# EasyEDA Pro project ProDoc_PCB_PCB_ESP32-sd-int_2026-03-25.epro

# Board PCB_PCB_ESP32-sd-int
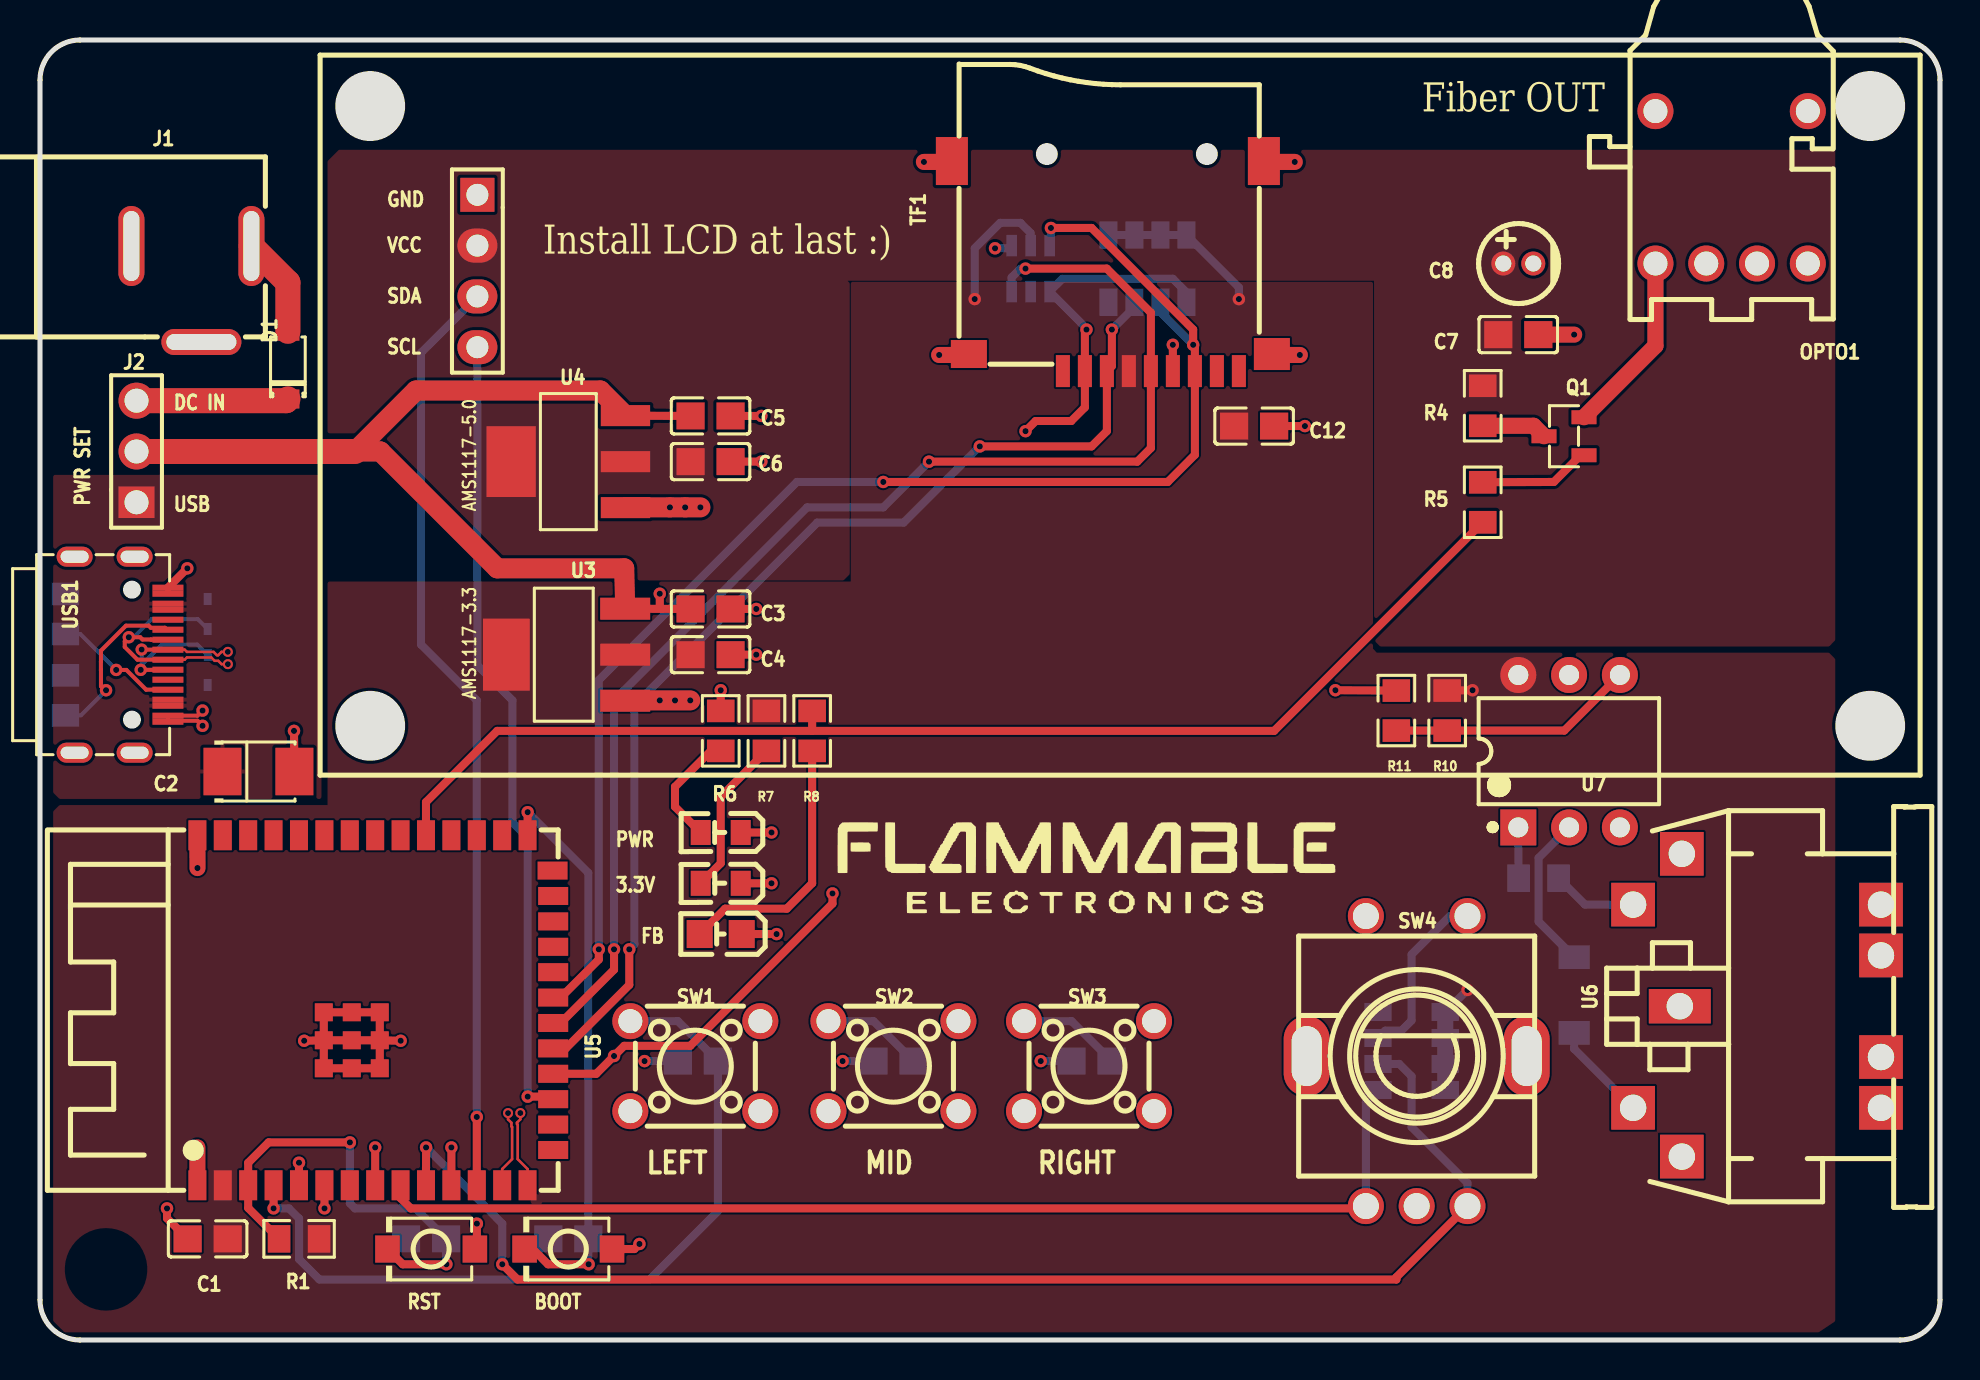
[diagram p0: board, top side]
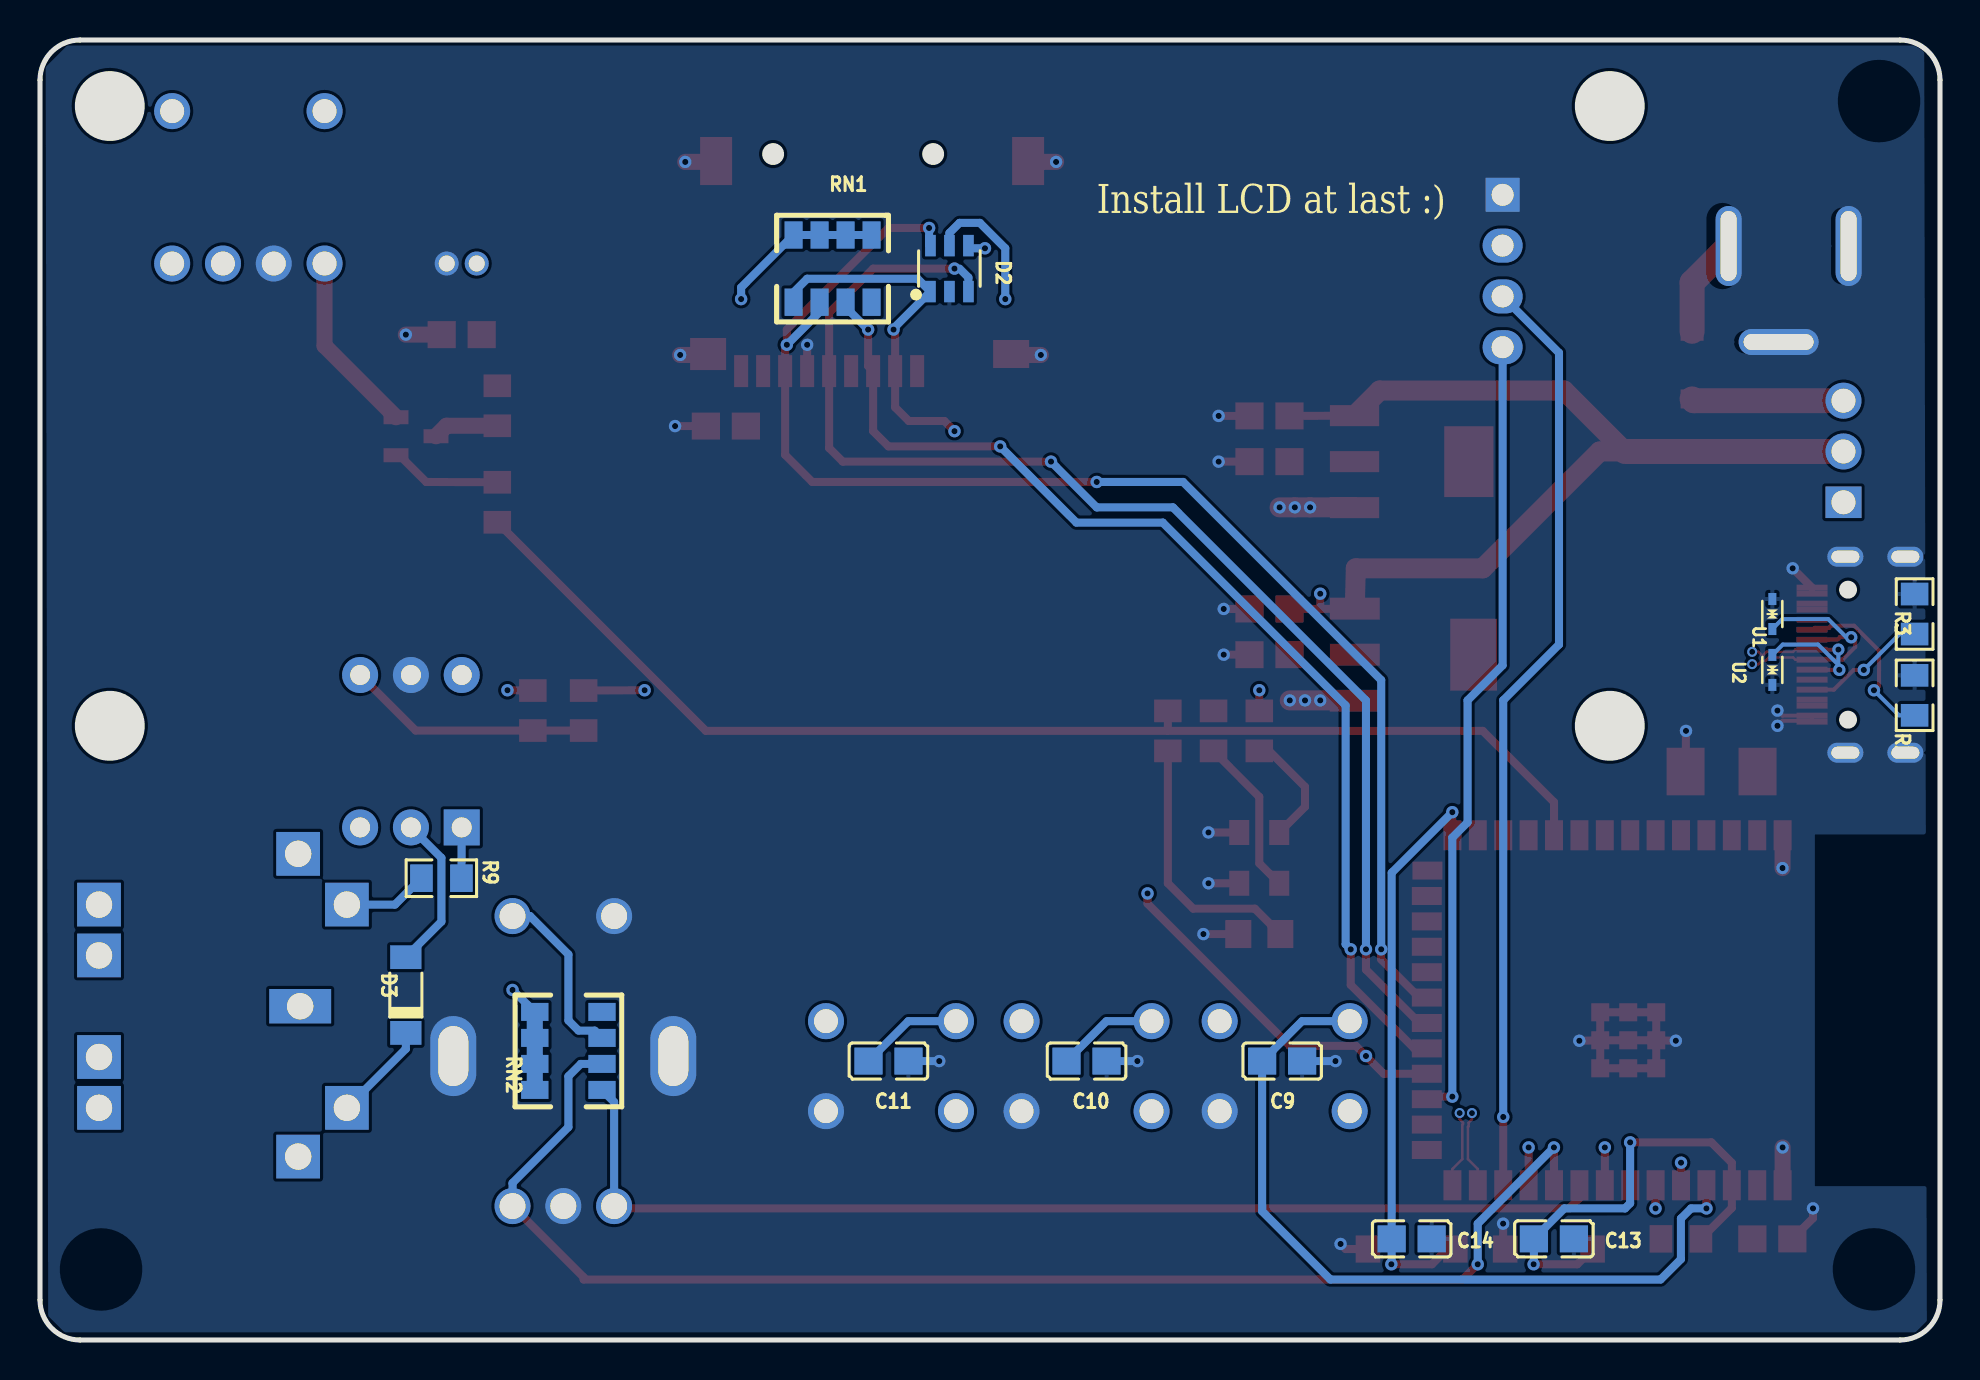
[diagram p1: board, bottom side, seen from below]

Outline 95 x 65 mm; copper layers: Top Layer, Inner1, Inner2, Inner3, Inner4, Inner5, Inner6, Inner7, Inner8, Inner9, Inner10, Inner11, Inner12, Inner13, Inner14, Inner15, Inner16, Inner17, Inner18, Inner19, Inner20, Inner21, Inner22, Inner23, Inner24, Inner25, Inner26, Inner27, Inner28, Inner29, Inner30, Bottom Layer. Coordinates in mm from the lower left corner of the outline.
Outline path: 0,63 arc(0.59,64.41) 2,65 93,65 arc(94.41,64.41) 95,63 95,2 arc(94.41,0.59) 93,0 2,0 arc(0.59,0.59) 0,2 0,63
Stack: Top Layer 0.035mm / Dielectric1 0.48mm PP er 4.5 / Inner1 0.035mm / Dielectric2 0.48mm FR4 er 4.5 / Inner2 0.035mm / Dielectric3 0.48mm PP er 4.5 / Bottom Layer 0.035mm

## Design rules (mm)
net USB_P: DP1
net USB_N: DP1
template: User Custom Config
spacing Default (default): track to track 0.1, other pairs 0 to 0.1
track width Default (default): min 0.254, default 0.254, max 25.4
differential pair differentialPair (default): width min 0.127, default 0.127, max 0.127; gap min 0.152, default 0.152
via Default (default): diameter min 0.5, default 0.6, max 100.025; hole min 0.3, default 0.305, max 59.995
pour e112 uses gge9877
pour e150 uses gge9877(1)
pour e340 uses gge17314
pour e342 uses gge17404
pour e344 uses gge17428
pour e346 uses gge21029

## Placement (name value [footprint] x y rotation side)
C1  100nF  [C0805]  8.38 5.06 0 top
C2  10uF  [CAP-SMD_L3.2-W2.8-FD]  10.92 28.42 0 top
C3  10uF  [C0805]  33.53 36.55 180 top
C4  10uF  [C0805]  33.53 34.27 180 top
C5  10uF  [C0805]  33.53 46.2 180 top
C6  10uF  [C0805]  33.53 43.92 180 top
C7  100nF  [C0805]  73.91 50.27 0 top
C8  10uF  [CAP-TH_BD4.0-P1.50-D0.8-FD]  73.91 53.82 0 top
C9  100nF  [C0805]  32.89 13.95 0 bottom
C10  100nF  [C0805]  42.67 13.95 0 bottom
C11  100nF  [C0805]  52.58 13.95 0 bottom
C12  100nF  [C0805]  60.71 45.7 0 top
C13  100nF  [C0805]  19.3 5.06 0 bottom
C14  100nF  [C0805]  26.42 5.06 0 bottom
D1  DSS34  [SOD-123_L2.8-W1.8-LS3.7-RD]  12.39 48.74 90 top
D2  BV-SRV05-4  [SOT-23-6_L2.9-W1.6-P0.95-LS2.8-BL]  49.53 53.57 180 bottom
D3  1N4148-1206D  [LL-34_L3.5-W1.5-R-RD]  76.71 17.25 90 bottom
J1  9V Battery  [DC-IN-TH_DC-5520-1]  7.57 52.3 0 top
J2  Power settings  [HDR-TH_3P-P2.54-V-M-1]  4.83 44.43 90 top
LCD1  -  [I2CLCD16X2]  16.51 30.71 0 top
LED1  0805 SF-RED  [LED0805-RD_RED]  34.04 22.84 180 top
LED2  SF-RED  [LED0805-RD_RED]  34.04 25.38 180 top
LED3  YLED0805G  [LED0805-FD-GREEN]  34.03 20.3 0 top
OPTO1  HFBR-1521Z  [CONN-TH_HFBR-1521Z]  84.58 57.63 180 top
Q1  SS8050S  [SOT-23-3_L2.9-W1.3-P0.95-LS2.4-BR]  76.2 45.19 0 top
R1  10kΩ  [R0805]  12.95 5.06 0 top
R2  5.1kΩ  [R0805]  1.27 32.23 270 bottom
R3  5.1kΩ  [R0805]  1.27 36.3 270 bottom
R4  33Ω  [R0805]  72.14 46.71 90 top
R5  470Ω  [R0805]  72.14 41.89 90 top
R6  10kΩ  [R0805]  34.04 30.46 90 top
R7  1.3kΩ  [R0805]  36.32 30.46 90 top
R8  2.2kΩ  [R0805]  38.61 30.46 270 top
R9  220Ω  [R0805]  74.93 23.09 180 bottom
R10  180Ω  [R0805]  70.36 31.47 270 top
R11  47Ω  [R0805]  67.82 31.47 90 top
RN1  10kΩ  [RES-ARRAY-SMD_1206-8P-L5.1-W3.1-BL]  55.37 53.57 180 bottom
RN2  10kΩ  [RES-ARRAY-SMD_1206-8P-L5.1-W3.1-BL]  68.58 14.45 90 bottom
SW1  TC-6610-18.0  [SW-TH_4P-L6.0-W6.0-P4.50-LS6.5]  32.77 13.69 0 top
SW2  TC-6610-18.0  [SW-TH_4P-L6.0-W6.0-P4.50-LS6.5]  42.67 13.69 0 top
SW3  TC-6610-18.0  [SW-TH_4P-L6.0-W6.0-P4.50-LS6.5]  52.45 13.69 0 top
SW4  EC11E18244A5  [SW-TH_EC11E18244A5]  68.83 13.95 0 top
SW5  TS-1088-AR02016  [SW-SMD_L3.9-W3.0-P4.45]  19.56 4.55 180 top
SW6  TS-1088-AR02016  [SW-SMD_L3.9-W3.0-P4.45]  26.42 4.55 180 top
TF1  SD  [TF-SMD_TF-15-15]  53.59 53.7 90 top
U1  LESD5D5.0CT1G_C5246195  [SOD-523_L1.2-W0.8-LS1.6-BI]  8.38 36.3 270 bottom
U2  LESD5D5.0CT1G_C5246195  [SOD-523_L1.2-W0.8-LS1.6-BI]  8.38 33.5 90 bottom
U3  AMS1117-3.3  [SOT-223-3_L6.5-W3.4-P2.30-LS7.0-BR]  26.29 34.27 0 top
U4  AMS1117-5.0  [SOT-223_L6.5-W3.5-P2.30-LS7.0-BR]  26.42 43.92 0 top
U5  ESP32-S3-WROOM-1(N8R8)  [WIRELM-SMD_ESP32-S3-WROOM-1]  16.76 16.49 90 top
U6  MIDIJACK  [CP-2350]  85.85 16.74 90 top
U7  H11L1  [DIP-6_L8.5-W6.4-P2.54-LS7.6-BL]  76.45 29.44 0 top
USB1  MUP-U20409-2  [USB-C-SMD_MUP-U20409-2]  4.06 34.27 270 top

## Footprints (pads in the part's own frame, mm; a bottom-side part is the same pattern mirrored in y, then rotated)
C0805
  rect 1.41x1.35 smd: 1(-1,0) 2(1,0)
CAP-SMD_L3.2-W2.8-FD
  rect 1.9x2.376 smd: 1(-1.798,0) 2(1.798,0)
CAP-TH_BD4.0-P1.50-D0.8-FD
  round 1.2 hole 0.8: 1(-0.75,0) 2(0.75,0)
CONN-TH_HFBR-1521Z
  round 1.8 hole 1.2: 1(3.81,3.81) 2(1.27,3.81) 3(-1.27,3.81) 4(-3.81,3.81) 5(-3.81,-3.81) 8(3.81,-3.81)
CP-2350
  rect 2.184x2.184 hole 1.321: 1(7.569,3.76) 3(-7.569,3.76) 4(5.029,6.197) 5(-5.131,6.197) PE(-2.591,-6.197) PE1(-5.131,-6.197) PE2(5.029,-6.197) PE@(2.489,-6.197)
  rect 1.72x3.096 hole 1.321: 2(-0.051,3.861)
DC-IN-TH_DC-5520-1
  oval 4x1.3 hole 3.5x0.8: 2(0.5,-2.4)
  oval 1.3x4 hole 0.8x3.5: 3(-3,2.4) 4(3,2.4)
DIP-6_L8.5-W6.4-P2.54-LS7.6-BL
  rect 1.8x1.8 hole 1: 1(-2.54,-3.81)
  round 1.8 hole 1: 2(0,-3.81) 3(2.54,-3.81) 4(2.54,3.81) 5(0,3.81) 6(-2.54,3.81)
HDR-TH_3P-P2.54-V-M-1
  rect 1.575x1.8 hole 1.2: 1(-2.54,0)
  round 1.8 hole 1.2: 2(0,0) 3(2.54,0)
I2CLCD16X2
  rect 1.7x1.7 hole 1.1: 1(5.359,26.549)
  oval 2x1.7 hole 1.1: 2(5.359,24.009) 3(5.359,21.469) 4(5.359,18.929)
LED0805-FD-GREEN
  rect 1.3x1.399 smd: 1(-1.05,0) 2(1.05,0)
LED0805-RD_RED
  rect 1x1.25 smd: 1(-1,0) 2(1,0)
LL-34_L3.5-W1.5-R-RD
  rect 1.185x1.566 smd: 1(1.893,0) 2(-1.893,0)
R0805
  rect 1.133x1.377 smd: 1(-1,0) 2(1,0)
RES-ARRAY-SMD_1206-8P-L5.1-W3.1-BL
  rect 0.9x1.37 smd: 1(-1.95,-1.68) 2(-0.65,-1.68) 3(0.65,-1.68) 4(1.95,-1.68) 5(1.95,1.68) 6(0.65,1.68) 7(-0.65,1.68) 8(-1.95,1.68)
SOD-123_L2.8-W1.8-LS3.7-RD
  rect 0.95x1.15 smd: 1(-1.692,0) 2(1.692,0)
SOD-523_L1.2-W0.8-LS1.6-BI
  rect 0.6x0.4 smd: 1(-0.75,0) 2(0.75,0)
SOT-23-3_L2.9-W1.3-P0.95-LS2.4-BR
  rect 1.25x0.7 smd: 1(1,-0.95) 2(1,0.95) 3(-1,0)
SOT-23-6_L2.9-W1.6-P0.95-LS2.8-BL
  rect 0.532x1.072 smd: 1(-0.95,-1.149) 2(0,-1.149) 3(0.95,-1.149) 4(0.95,1.149) 5(0,1.149) 6(-0.95,1.149)
SOT-223-3_L6.5-W3.4-P2.30-LS7.0-BR
  rect 2.5x1.1 smd: 1(2.97,-2.3) 2(2.97,0) 3(2.97,2.3)
  rect 2.34x3.6 smd: 4(-2.97,0)
SOT-223_L6.5-W3.5-P2.30-LS7.0-BR
  rect 2.465x1.05 smd: 1(2.857,-2.3) 2(2.857,0) 3(2.857,2.3)
  rect 2.465x3.54 smd: 4(-2.857,0)
SW-SMD_L3.9-W3.0-P4.45
  rect 1.23x1.36 smd: 1(-2.185,0) 2(2.185,0)
SW-TH_4P-L6.0-W6.0-P4.50-LS6.5
  round 1.8 hole 1.2: 1(-3.25,2.25) 2(3.25,2.25) 3(-3.25,-2.25) 4(3.25,-2.25)
SW-TH_EC11E18244A5
  oval 2.3x4 hole 1.5x3: 6(5.5,0.25) 7(-5.5,0.25)
  round 1.8 hole 1.3: A(-2.54,-7.25) B(2.54,-7.25) C(0,-7.25) D(-2.54,7.25) E(2.54,7.25)
TF-SMD_TF-15-15
  rect 1.6x0.701 smd: 1(-5.252,2.45) 2(-5.252,1.35) 3(-5.252,0.25) 4(-5.252,-0.85) 5(-5.252,-1.95) 6(-5.252,-3.05) 7(-5.252,-4.15) 8(-5.252,-5.25) 9(-5.252,-6.35)
  rect 1.6x1.8 smd: 10(-4.399,-8)
  rect 2.4x1.6 smd: 11(5.252,-7.6) 12(5.252,8)
  rect 1.399x1.801 smd: 13(-4.398,7.151)
USB-C-SMD_MUP-U20409-2
  oval 1x1.8 hole 0.6x1.4: 17(4.9,0.667) 18(4.9,-2.333) 19(-4.9,-2.333) 20(-4.9,0.667)
  rect 0.3x1.55 smd: A1(-3.35,2.333) A4(-2.55,2.333) A5(-1.25,2.333) A6(-0.25,2.333) A7(0.25,2.333) A8(1.25,2.333) A9(2.55,2.333) A12(3.35,2.333) B1(3.05,2.333) B4(2.25,2.333) B5(1.75,2.333) B6(0.75,2.333) B7(-0.75,2.333) B8(-1.75,2.333) B9(-2.25,2.333) B12(-3.05,2.333)
WIRELM-SMD_ESP32-S3-WROOM-1
  rect 1.5x0.9 smd: 1(-8.75,8.895) 2(-8.75,7.625) 3(-8.75,6.355) 4(-8.75,5.085) 5(-8.75,3.815) 6(-8.75,2.545) 7(-8.75,1.275) 8(-8.75,0.005) 9(-8.75,-1.265) 10(-8.75,-2.535) 11(-8.75,-3.805) 12(-8.75,-5.075) 13(-8.75,-6.345) 14(-8.75,-7.615) 27(8.75,-7.615) 28(8.75,-6.345) 29(8.75,-5.075) 30(8.75,-3.805) 31(8.75,-2.535) 32(8.75,-1.265) 33(8.75,0.005) 34(8.75,1.275) 35(8.75,2.545) 36(8.75,3.815) 37(8.75,5.085) 38(8.75,6.355) 39(8.75,7.625) 40(8.75,8.895)
  rect 0.9x1.5 smd: 15(-6.985,-8.895) 16(-5.715,-8.895) 17(-4.445,-8.895) 18(-3.175,-8.895) 19(-1.905,-8.895) 20(-0.635,-8.895) 21(0.635,-8.895) 22(1.905,-8.895) 23(3.175,-8.895) 24(4.445,-8.895) 25(5.715,-8.895) 26(6.985,-8.865)
  rect 0.9x0.9 smd: 41(-2.9,2.575) 41(-2.9,1.175) 41(-2.9,-0.225) 41(-1.5,2.575) 41(-1.5,1.175) 41(-1.5,-0.226) 41(-0.1,2.575) 41(-0.1,1.175) 41(-0.1,-0.225)

## Nets
+3.3V: C1.2 C4.2 C12.1 D2.5 R1.2 R7.2 R10.1 RN1.5 RN1.6 RN1.7 RN1.8 RN2.5 RN2.6 RN2.7 RN2.8 TF1.4 U3.2 U3.4 U5.2 U7.6
+5V: C6.2 C7.1 C8.1 LCD1.2 R4.2 U4.2 U4.4
GND: C1.1 C2.2 C3.1 C4.1 C5.1 C6.1 C7.2 C8.2 C9.1 C10.1 C11.1 C12.2 C13.1 C14.1 D2.2 J1.2 J1.3 LCD1.1 LED1.1 LED2.1 LED3.2 OPTO1.2 R2.1 R3.1 SW1.4 SW2.4 SW3.4 SW4.6 SW4.7 SW4.C SW4.D SW5.1 SW6.1 TF1.6 TF1.10 TF1.11 TF1.12 TF1.13 U1.1 U2.1 U3.1 U4.1 U5.1 U5.40 U5.41 U7.5 USB1.17 USB1.18 USB1.19 USB1.20 USB1.A1 USB1.A12 USB1.B1 USB1.B12
VBUS: C2.1 J2.1 USB1.A4 USB1.A9 USB1.B4 USB1.B9
VIN: D1.2 J1.4
BTN1: C9.2 SW1.1 U5.4
BTN2: C10.2 SW2.1 U5.5
BTN3: C11.2 SW3.1 U5.6
CHIP_EN: C13.2 R1.1 SW5.2 U5.3
CLK: D2.3 TF1.5 U5.20
CS: D2.1 RN1.1 TF1.2 U5.18
ENC_A: RN2.1 SW4.A U5.9
ENC_B: RN2.2 SW4.B U5.10
ENC_SW: RN2.3 SW4.E U5.11
FB: R5.1 R8.1 U5.31
IO0: C14.2 SW6.2 U5.27
MIDI_RX: R11.2 U5.8
MISO: D2.6 RN1.2 TF1.7 U5.21
MOSI: D2.4 RN1.3 TF1.3 U5.19
SCLK: LCD1.4 U5.17
SDA: LCD1.3 U5.12
USB_N: U1.2 U5.13 USB1.A7 USB1.B7
USB_P: U2.2 U5.14 USB1.A6 USB1.B6
VSET: C3.2 C5.2 J2.2 R6.2 U3.3 U4.3
$1N2: R3.2 USB1.B5
$1N4: R2.2 USB1.A5
$1N45: Q1.1 R5.2
$1N72: D1.1 J2.3
$1N93: LED2.2 R6.1
$1N100: R9.1 U6.4
$1N101: R9.2 U7.1
$1N102: D3.1 U7.2
$1N103: D3.2 U6.5
$1N106: R10.2 R11.1 U7.4
$1N109: Q1.3 R4.1
$1N110: OPTO1.1 Q1.2
$1N111: LED3.1 R8.2
$1N114: LED1.2 R7.1

Pads without a net: OPTO1 3 4 5 8; RN1 4; RN2 4; SW1 2 3; SW2 2 3; SW3 2 3; TF1 1 8 9; U5 7 15 16 22 23 24 25 26 28 29 30 32 33 34 35 36 37 38 39; U6 1 2 3 PE PE1 PE2 PE@; U7 3; USB1 A8 B8

## Via types
v1: diameter 0.62, hole 0.31, Top Layer to Bottom Layer, 73 vias
v2: diameter 0.5, hole 0.3, Top Layer to Bottom Layer, 4 vias
v3: diameter 0.61, hole 0.305, Top Layer to Bottom Layer, 1 via

## Routing (per net, layer and track width the routed paths; a pad name or vN(x,y) marks a point on that pad's centre or on a via; arc(x,y) is an arc through that point)
+3.3V: length 21.6
  Top Layer w0.402: R10.1 v1(71.63,32.49)
  Bottom Layer w0.402: v1(46.74,52.05) 46.74,54.59 48.01,55.86 49.02,55.86 49.53,55.35 D2.5 ; RN1.5 RN1.6 RN1.7 RN1.8 59.94,52.63 v1(59.94,52.05) ; RN2.5 v1(71.37,17.5)
  Bottom Layer w0.803: RN2.8 RN2.7 RN2.6 RN2.5
GND: length 64.8
  Top Layer w0.201: v1(8.13,31.47) 7.87,31.22 USB1.B1 USB1.A12 6.44,30.96 7.87,30.96 v1(8.13,30.71) ; USB1.A1 USB1.B12
  Top Layer w0.402: C4.1 v1(35.81,34.27) ; 16.99,14.99 U5.41 U5.41 U5.41 ; 16.99,14.99 U5.41 U5.41 U5.41 ; 16.99,14.99 U5.41 ; USB1.A1 7.36,38.58 ; v1(13.21,14.96) 14.19,14.98 ; C1.1 6.35,6.09 v1(6.35,6.58) ; C2.2 v1(12.7,30.46) ; C12.2 v1(63.25,45.7) ; LED1.1 v1(36.58,22.84) ; 56.64,48.44 v1(56.64,49.76) ; C6.1 v1(36.07,43.92) ; v1(29.97,4.8) 29.72,4.55 SW6.1 ; LED2.1 v1(36.58,25.38) ; C5.1 v1(36.07,46.2) ; 35.09,20.3 v1(36.83,20.3) ; C3.1 v1(35.81,36.55) ; 16.99,14.98 v1(18.03,14.96) ; v1(21.84,5.82) 21.84,4.65 SW5.1
  Top Layer w0.803: v1(62.74,58.9) 61.24,58.9 TF1.11 ; TF1.13 46.4,49.25 v1(44.96,49.25) ; TF1.12 45.55,58.9 v1(44.2,58.9) ; TF1.10 61.64,49.25 v1(62.99,49.25) ; C7.2 v1(76.71,50.27) ; U5.1 v1(7.87,9.63) ; U5.40 v1(7.87,23.6)
  Top Layer w1: v1(33.02,41.63) v1(32.26,41.63) v1(31.5,41.63) 29.29,41.63 29.27,41.62 ; v1(32.51,31.98) 29.29,31.98 29.26,31.95
  Bottom Layer w0.402: v1(40.13,13.95) C10.1 ; C9.1 v1(30.23,13.95) ; v1(50.04,13.95) C11.1
  vias: v1(7.37,38.58) v1(30.99,31.98) v1(31.75,31.98)
VIN: length 5
  Top Layer w1.25: D1.2 12.39,52.87 J1.4
BTN1: length 40.2
  Top Layer w0.402: U5.4 v1(11.68,6.58)
  Bottom Layer w0.402: SW1.1 31.9,15.94 C9.2 33.89,6.44 30.48,3.02 13.97,3.02 12.95,4.04 12.95,6.07 12.45,6.58 v1(11.68,6.58)
BTN2: length 38.1
  Top Layer w0.402: U5.5 v1(12.95,8.87)
  Inner1 w0.402: v1(12.95,8.87) 36.58,8.87 37.59,9.88 37.59,14.11 SW2.1
  Bottom Layer w0.402: SW2.1 41.68,15.94 C10.2
BTN3: length 47.6
  Top Layer w0.402: v1(14.22,6.58) U5.6
  Inner1 w0.402: SW3.1 47.5,14.24 47.5,10.14 43.94,6.58 v1(14.22,6.58)
  Bottom Layer w0.402: SW3.1 51.58,15.94 C11.2
CHIP_EN: length 23.1
  Top Layer w0.402: v1(15.49,9.88) 11.43,9.88 10.41,8.86 U5.3 10.41,6.6 R1.1 ; v1(20.32,3.79) 18.13,3.79 SW5.2
  Bottom Layer w0.402: v1(15.49,9.88) 15.49,6.83 15.75,6.58 18.78,6.58 C13.2 20.3,3.8 v1(20.32,3.79)
CLK: length 65
  Top Layer w0.402: v1(28.7,19.53) 28.7,18.52 26.03,15.85 25.66,15.85 ; v1(44.45,43.92) 54.86,43.92 55.54,44.6 TF1.5 ; 55.54,48.44 55.54,51.37 53.34,53.57 v1(49.28,53.57)
  Bottom Layer w0.402: v1(28.7,19.53) 28.7,31.98 38.35,41.63 42.16,41.63 v1(44.45,43.92) ; 49.02,53.57 48.58,53.13 D2.3
CS: length 63
  Top Layer w0.402: v1(49.28,45.44) 49.78,45.95 51.56,45.95 52.24,46.63 TF1.2 52.24,50.44 v1(52.32,50.52) ; 25.66,13.31 27.81,13.31 v1(28.7,14.2) 29.21,14.71 32.51,14.71 39.62,21.82 v1(39.62,22.33)
  Inner1 w0.402: v1(49.28,45.44) 49.28,31.98 v1(39.62,22.33)
  Bottom Layer w0.402: RN1.1 57.32,52.38 56.64,53.06 51.12,53.06 D2.1 52.32,50.58 v1(52.32,50.52)
ENC_A: length 55.2
  Top Layer w0.402: U5.9 18.03,7.09 18.54,6.58 66.18,6.58 SW4.A
  Bottom Layer w0.402: RN2.1 66.29,11.9 SW4.A
ENC_B: length 69.1
  Top Layer w0.402: v1(23.11,3.79) 23.88,3.02 67.82,3.02 67.82,3.14 SW4.B ; 19.3,7.74 19.3,8.61 19.3,8.61 v1(19.3,9.63)
  Bottom Layer w0.402: RN2.2 67.96,13.8 68.58,13.18 68.58,10.64 71.37,7.85 SW4.B ; v1(19.3,9.63) 23.11,5.82 v1(23.11,3.79)
ENC_SW: length 70.1
  Top Layer w0.402: U5.11 v1(20.57,9.63)
  Inner1 w0.402: v1(20.57,9.63) 26.92,9.63 27.94,10.64 27.94,16.99 29.21,18.26 68.44,18.26 SW4.E
  Bottom Layer w0.402: RN2.3 67.27,15.47 68.07,15.47 68.58,15.98 68.58,19.28 70.5,21.2 SW4.E
FB: length 61.3
  Top Layer w0.402: R8.1 38.61,30.46 ; R5.1 61.71,30.46 22.86,30.46 19.3,26.89 19.3,25.24
IO0: length 28.5
  Top Layer w0.402: v1(27.43,3.79) 25.4,3.79 24.64,4.55 SW6.2 ; 24.38,25.24 v1(24.38,26.39)
  Bottom Layer w0.402: v1(27.43,3.79) 27.42,3.8 C14.2 27.42,23.36 v1(24.38,26.39)
MIDI_RX: length 71
  Top Layer w0.402: U5.8 v1(16.76,9.63) ; v1(64.77,32.49) R11.2
  Inner1 w0.402: v1(16.76,9.63) 17.78,10.64 26.67,10.64 27.18,11.15 27.18,16.99 29.21,19.03 60.2,19.03 62.99,21.82 62.99,30.71 v1(64.77,32.49)
MISO: length 70.7
  Top Layer w0.402: 25.66,17.12 26.03,17.12 27.94,19.03 v1(27.94,19.53) ; v1(42.16,42.9) 56.39,42.9 57.74,44.26 TF1.7 57.74,49.67 v1(57.66,49.76) 57.66,50.52 52.58,55.6 v1(50.55,55.6)
  Bottom Layer w0.402: v1(50.55,55.6) 50.55,54.78 D2.6 ; v1(42.16,42.9) 37.85,42.9 27.94,33 v1(27.94,19.53) ; v1(57.66,49.76) 56.02,51.4 RN1.2
MOSI: length 64.2
  Top Layer w0.402: v1(46.99,44.68) 52.58,44.68 53.34,45.45 TF1.3 53.59,48.7 v1(53.59,50.52) ; 25.66,14.58 26.29,14.58 29.46,17.76 v1(29.46,19.53)
  Inner1 w0.402: v1(47.75,54.59) 47.75,53.57 49.78,51.54 52.58,51.54 53.34,50.78
  Bottom Layer w0.402: D2.4 48.45,54.59 v1(47.75,54.59) ; v1(29.46,19.53) 29.72,19.79 29.72,31.73 38.86,40.87 43.18,40.87 v1(46.99,44.68) ; v1(53.59,50.52) 54.72,51.65 RN1.3
SCLK: length 39.8
  Top Layer w0.402: v1(24.38,12.17) 25.53,12.17 25.66,12.04
  Bottom Layer w0.402: v1(24.38,12.17) 24.38,25.12 23.62,25.88 23.62,31.98 21.87,33.73 LCD1.4
SDA: length 46.8
  Top Layer w0.402: U5.12 v1(21.84,11.15)
  Bottom Layer w0.402: v1(21.84,11.15) 21.84,31.98 19.05,34.77 19.05,49.36 LCD1.3
USB_N: length 45.5
  Top Layer w0.127: USB1.A7 7.23,34.02 7.35,34.13 8.56,34.13 8.73,33.96 8.91,33.96 9.08,33.79 v2(9.39,33.79) ; v2(23.4,11.35) 23.4,11.03 23.57,10.86 23.57,10.68 23.6,10.65 23.6,9.05 23.11,8.55 U5.13
  Top Layer w0.201: USB1.B7 5.55,35.02 5.54,35.03 5.12,35.03 5.01,35.14 v1(4.44,35.14) 4.24,34.94 4.24,34.65 4.87,34.02 USB1.A7
  Inner1 w0.127: v2(23.4,11.35) 23.4,11.66 23.57,11.83 23.57,11.89 9.98,25.48 9.98,33.92 9.94,33.96 9.88,33.96 9.71,33.79 v2(9.39,33.79)
  Bottom Layer w0.201: U1.2 7.89,36.04 5.59,36.04 4.68,35.14 v1(4.44,35.14)
USB_P: length 44.1
  Top Layer w0.127: v2(9.39,34.41) 9.08,34.41 8.91,34.24 8.85,34.24 8.68,34.41 7.35,34.41 7.23,34.52 USB1.A6 ; v2(24.02,11.35) 24.02,11.03 23.85,10.87 23.85,10.8 23.88,10.77 23.88,9.05 24.38,8.55 24.38,7.74
  Top Layer w0.201: v3(5.08,34.52) 5.09,34.52 USB1.A6 ; v1(5.04,33.51) 6.39,33.51 USB1.B6
  Inner1 w0.127: v2(24.02,11.35) 24.02,11.66 23.85,11.83 23.85,12.01 10.26,25.6 10.26,34.03 10.06,34.24 9.87,34.24 9.7,34.41 v2(9.39,34.41)
  Bottom Layer w0.201: 5.08,33.76 6.1,34.77 7.86,34.77 U2.2 ; 5.08,33.76 5.08,33.55 v1(5.04,33.51) ; 5.08,33.76 v3(5.08,34.52)
VSET: length 58.6
  Top Layer w0.402: R6.2 v1(34.04,32.49) ; 29.27,46.22 C5.2 ; 29.26,36.56 C3.2 ; 31.09,36.56 30.99,36.66 v1(30.99,37.31)
  Top Layer w1: 29.26,36.56 29.21,38.58 22.86,38.58 17.02,44.43 15.75,44.43 18.8,47.47 28.02,47.47 29.27,46.22
  Top Layer w1.25: J2.2 15.75,44.43
  Inner1 w0.402: v1(30.99,37.31) 34.04,34.27 v1(34.04,32.49)
$1N2: length 6.3
  Top Layer w0.201: USB1.B5 5.31,32.52 4.32,33.5 v1(3.81,33.5)
  Bottom Layer w0.201: R3.2 2.02,35.3 v1(3.81,33.5)
$1N4: length 8.6
  Top Layer w0.201: v1(3.3,32.49) 3.25,32.49 3.05,32.69 3.05,33.49 3.05,33.49 3.05,33.92 3.05,33.92 3.05,34.47 4.3,35.72 5.43,35.72 5.54,35.61 6.25,35.61 6.34,35.52 USB1.A5
  Bottom Layer w0.201: R2.2 2.05,31.23 v1(3.3,32.49)
$1N45: length 5.6
  Top Layer w0.402: 72.14,42.89 75.69,42.9 77.03,44.24 Q1.1
$1N72: length 7.6
  Top Layer w1.25: J2.3 12.31,46.97 D1.1
$1N93: length 5.8
  Top Layer w0.402: R6.1 33.54,29.46 31.75,27.66 31.75,26.66 LED2.2
$1N100: length 4.3
  Bottom Layer w0.402: U6.4 77.25,21.77 R9.1
$1N101: length 2.5
  Bottom Layer w0.402: 73.93,23.09 U7.1
$1N102: length 7.9
  Bottom Layer w0.402: U7.2 74.93,24.11 74.93,20.92 D3.1
$1N103: length 5
  Bottom Layer w0.402: U6.5 76.71,14.56 D3.2
$1N106: length 12.3
  Top Layer w0.402: R11.1 R10.2 76.22,30.47 U7.4
$1N109: length 3.3
  Top Layer w0.803: Q1.3 74.68,45.71 R4.1
$1N110: length 9.2
  Top Layer w0.803: Q1.2 80.77,49.71 OPTO1.1
$1N111: length 13.3
  Top Layer w0.402: R8.2 38.61,22.84 37.34,21.57 34.26,21.57 32.99,20.3
$1N114: length 8
  Top Layer w0.402: 33.04,22.84 34.04,23.83 34.04,27.15 R7.1

## Copper pours and planes (outline as drawn; the poured copper is in the pictures)
+3.3V on Top Layer: 14.48,37.82 14.48,26.65 1.02,26.65 0.76,26.39 0.76,0.99 1.27,0.48 88.9,0.48 89.66,0.99 89.66,34.01 89.41,34.27 66.8,34.27 66.55,34.52 66.55,52.81 40.64,52.81 40.64,37.82
+5V on Top Layer: 89.66,35.03 89.41,34.77 67.06,34.77 66.8,35.03 66.8,53.06 40.13,53.06 40.39,52.81 40.39,38.33 40.13,38.08 14.73,38.08 14.48,38.33 14.48,58.9 14.99,59.41 89.66,59.41
GND on Bottom Layer: 0.89,64.62 0.76,0.99 1.27,0.48 93.73,0.48 94.49,1.25 94.62,63.6 93.6,64.62
GND on Inner2: 0.87,64.65 0.74,1.02 1.25,0.51 93.7,0.51 94.46,1.27 94.59,63.63 93.58,64.65
VBUS on Top Layer: 0.76,43.16 0.76,27.41 1.02,27.15 13.97,27.15 13.97,43.16
J2_3 on Top Layer: 0.76,59.41 0.76,45.7 13.72,45.7 13.97,45.95 13.97,58.9 13.46,59.41

## Text on the board
Bottom Silkscreen Layer: Install LCD at last :)
Top Silkscreen Layer: AMS1117-5.0 | AMS1117-3.3 | DC IN | USB | GND | VCC | SDA | SCL | RST | BOOT | PWR | 3.3V | FB | PWR SET | LEFT | MID | RIGHT | Install LCD at last :) | Fiber OUT
